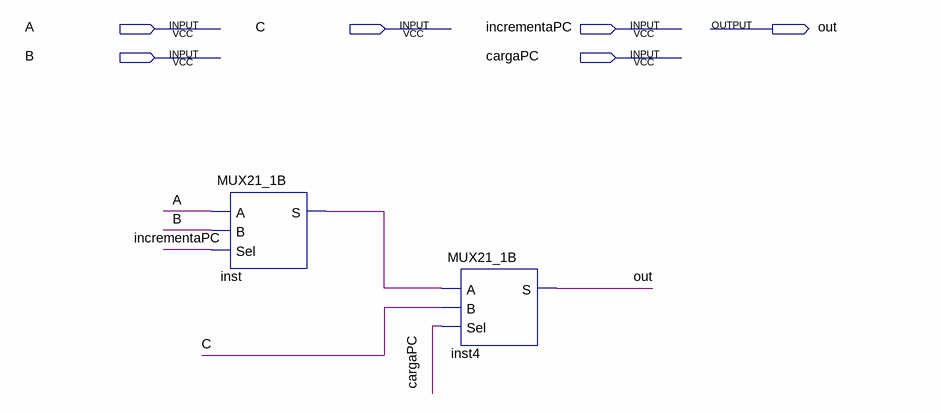
[diagram p0: schematic sheet]
// Quartus schematic MUX31_1B.bdf as structural Verilog: 2 symbols, 6 pins
module MUX31_1B (
  input  A,
  input  C,
  input  incrementaPC,
  input  B,
  input  cargaPC,
  output out
);

  wire inst_s;

  MUX21_1B inst (.A(A), .B(B), .Sel(incrementaPC), .S(inst_s));
  MUX21_1B inst4 (.A(inst_s), .B(C), .Sel(cargaPC), .S(out));
endmodule
